# EAGLE schematic ConnectBox_Charger (EAGLE 9.2.2)
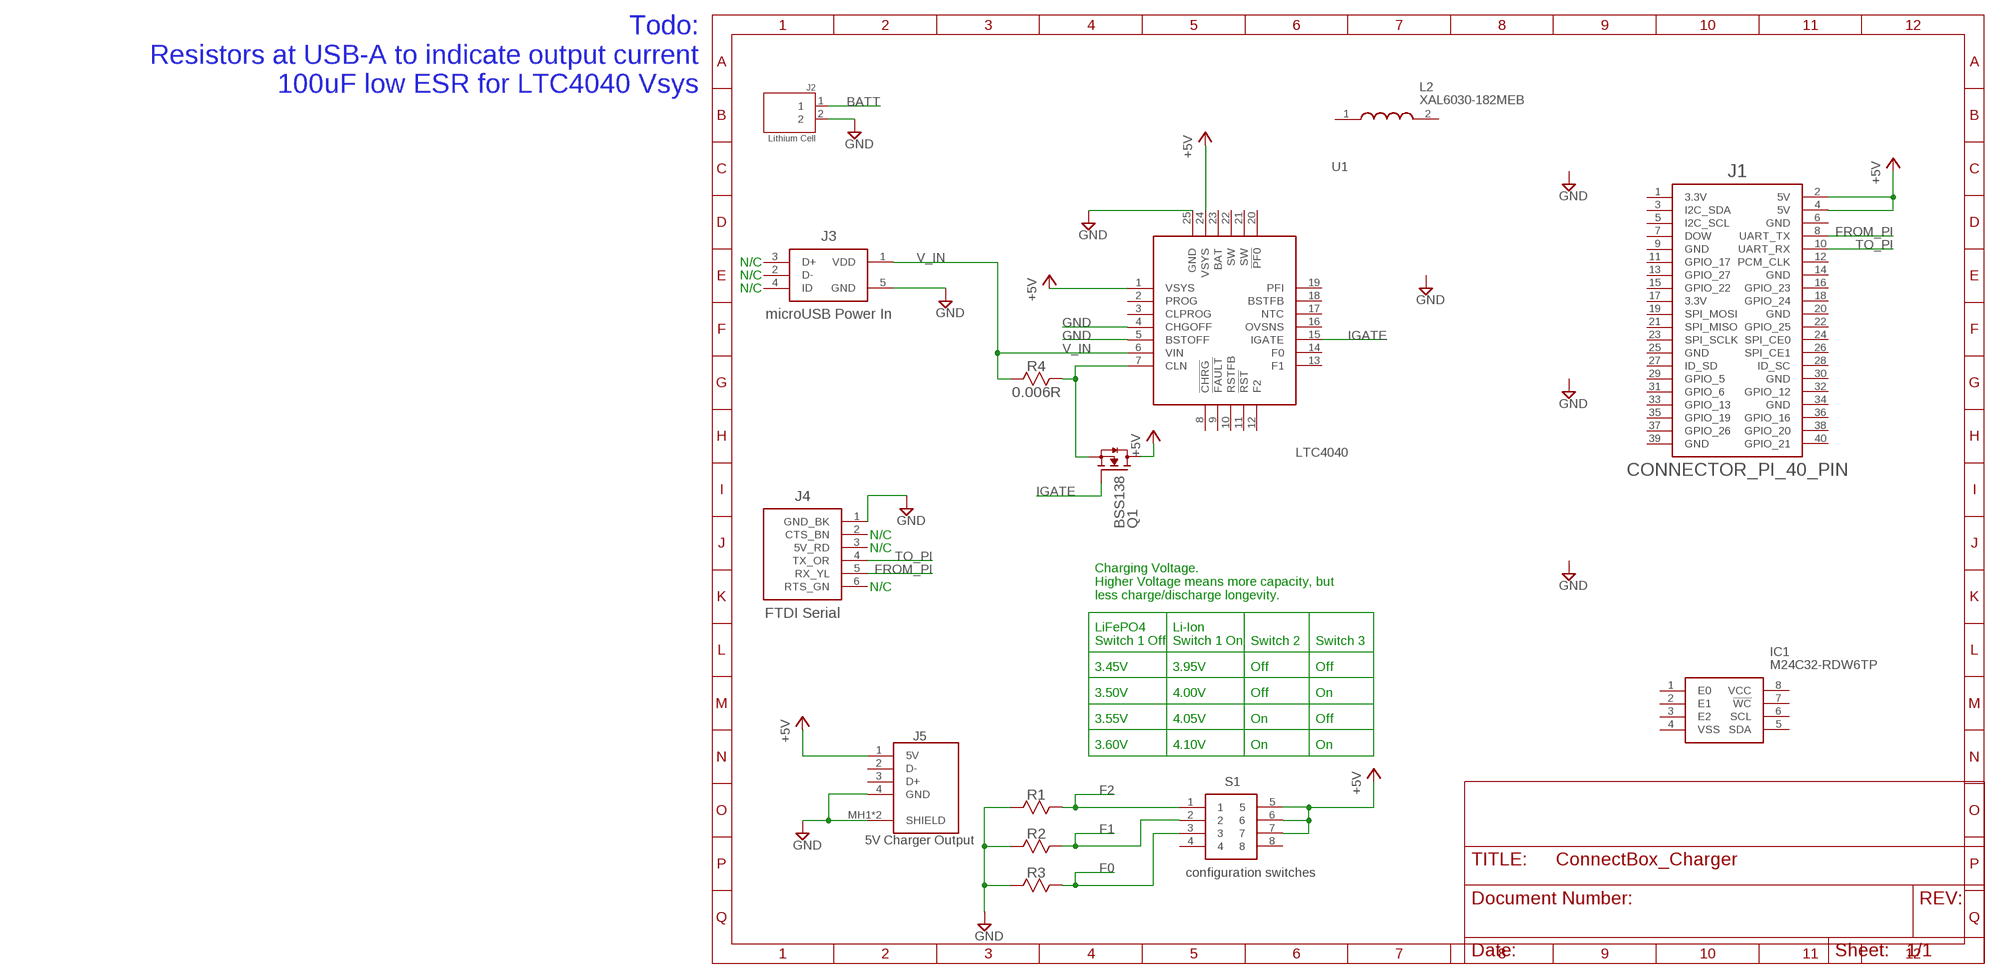
[diagram p0: schematic, sheet 1]

## Parts
IC1  M24C32-RDW6TP  [SOP65P640X120-8N]
J1  CONNECTOR_PI_40_PIN  [2X20]
J2  Lithium Cell  S2B-PH-SM4-TB(LF)(SN)  [JST_S2B-PH-SM4-TB(LF)(SN)]
J3  microUSB Power In  10118194-0001LF  [FRAMATOME_10118194-0001LF]
J4  FTDI Serial  CONNECTOR-6-FTDI  [ESQ-106-XX-X-S]
J5  5V Charger Output  SS-52100-001  [SS52100001]
L2  XAL6030-182MEB  [XAL6030182MEB]
Q1  BSS138  [BSS138]
R1  RESISTOR0603  [RESC1608X55L25N]
R2  RESISTOR0603  [RESC1608X55L25N]
R3  RESISTOR0603  [RESC1608X55L25N]
R4  0.006R  RESISTOR0603  [RESC1608X55L25N]
S1  configuration switches  219-4LPST  [219-4LPST]
U1  LTC4040  [QFN50P500X400X80-25N]

## Nets
+5V: J1.2(5V) J1.4(5V) J5.1(5V) Q1.D S1.5 S1.6 S1.7 U1.1(VSYS) U1.24(VSYS)
BATT: J2.1
F0: R3.2 S1.3
F1: R2.2 S1.2
F2: R1.2 S1.1
FROM_PI: J1.8(UART_TX) J4.5(RX_YL)
GND: J2.2 J3.5(GND) J4.1(GND_BK) J5.4(GND) J5.MH1(SHIELD) J5.MH2(SHIELD) R1.1 R2.1 R3.1 U1.4(CHGOFF) U1.5(BSTOFF) U1.25(GND)
IGATE: Q1.G U1.15(IGATE)
N$2: Q1.S R4.2 U1.7(CLN)
TO_PI: J1.10(UART_RX) J4.4(TX_OR)
V_IN: J3.1(VDD) R4.1 U1.6(VIN)
Unconnected: IC1.1(E0) IC1.2(E1) IC1.3(E2) IC1.4(VSS) IC1.5(SDA) IC1.6(SCL) IC1.7(!WC) IC1.8(VCC) J1.1(3.3V) J1.3(I2C_SDA) J1.5(I2C_SCL) J1.6(GND) J1.7(DOW) J1.9(GND) J1.11(GPIO_17) J1.12(PCM_CLK) J1.13(GPIO_27) J1.14(GND) J1.15(GPIO_22) J1.16(GPIO_23) J1.17(3.3V) J1.18(GPIO_24) J1.19(SPI_MOSI) J1.20(GND) J1.21(SPI_MISO) J1.22(GPIO_25) J1.23(SPI_SCLK) J1.24(SPI_CE0) J1.25(GND) J1.26(SPI_CE1) J1.27(ID_SD) J1.28(ID_SC) J1.29(GPIO_5) J1.30(GND) J1.31(GPIO_6) J1.32(GPIO_12) J1.33(GPIO_13) J1.34(GND) J1.35(GPIO_19) J1.36(GPIO_16) J1.37(GPIO_26) J1.38(GPIO_20) J1.39(GND) J1.40(GPIO_21) J3.2(D-) J3.3(D+) J3.4(ID) J4.2(CTS_BN) J4.3(5V_RD) J4.6(RTS_GN) J5.2(D-) J5.3(D+) L2.1 L2.2 S1.4 S1.8 U1.2(PROG) U1.3(CLPROG) U1.8(!CHRG) U1.9(!FAULT) U1.10(RSTFB) U1.11(!RST) U1.12(F2) U1.13(F1) U1.14(F0) U1.16(OVSNS) U1.17(NTC) U1.18(BSTFB) U1.19(PFI) U1.20(!PF0) U1.21(SW) U1.22(SW) U1.23(BAT)

## Notes on the sheet
- Todo:
  Resistors at USB-A to indicate output current
  100uF low ESR for LTC4040 Vsys
- N/C
- N/C
- N/C
- N/C
- N/C
- N/C
- Charging Voltage.
  Higher Voltage means more capacity, but
  less charge/discharge longevity.
- LiFePO4
  Switch 1 Off
- Li-Ion
  Switch 1 On
- Switch 2 | Switch 3
- 3.45V | 3.95V | Off | Off
- 3.50V | 4.00V | Off | On
- 3.55V | 4.05V | On | Off
- 3.60V | 4.10V | On | On

## Library data of the parts
IC1 = ConnectBox_2019:M24C32-RDW6TP: STMICROELECTRONICS - M24C32-RDW6TP - EEPROM, 32KBIT, I2C, 1MHZ, TSSOP-8 Source: Datasheet <http://www.st.com/content/ccc/resource/technical/document/datasheet/80/4e/8c/54/f2/63/4c/4a/CD00001012.pdf/files/CD00001012.pdf/jcr:content/translations/en.CD00001012.pdf>; DESCRIPTION: STMICROELECTRONICS - M24C32-RDW6TP - EEPROM, 32KBIT, I2C, 1MHZ, TSSOP-8; HEIGHT: 1.2mm; MANUFACTURER_NAME: STMicroelectronics; MANUFACTURER_PART_NUMBER: M24C32-RDW6TP; MOUSER_PART_NUMBER: 511-M24C32-RDW6TP; MOUSER_PRICE-STOCK: https://www.mouser.com/Search/Refine.aspx?Keyword=511-M24C32-RDW6TP
J1 = ConnectBox_2019:CONNECTOR_PI_40_PIN
J2 = ConnectBox_2019:S2B-PH-SM4-TB(LF)(SN): PH Series 2 Position 2 mm Pitch Surface Mount Side Entry Shrouded Header; AVAILABILITY: Unavailable; DESCRIPTION: PH Series 2 Position 2 mm Pitch Surface Mount Side Entry Shrouded Header; MF: JST Sales; MP: S2B-PH-SM4-TB_LF__SN_; PACKAGE: FakePackage u; PRICE: None
J3 = ConnectBox_2019:10118194-0001LF: Conn Micro USB Type B RCP 5 POS 0.65mm Solder RA SMD 5 Terminal 1 Port T/R from SnapEDA; AVAILABILITY: Good; DESCRIPTION: Conn Micro USB Type B RCP 5 POS 0.65mm Solder RA SMD 5 Terminal 1 Port T/R; MF: FCI; MP: 10118194-0001LF; PACKAGE: DIP-4 FCI; PRICE: 0.24 USD
J4 = ConnectBox_2019:CONNECTOR-6-FTDI
J5 = ConnectBox_2019:SS-52100-001: STEWART CONNECTOR - SS-52100-001 - USB CONN, 2.0 TYPE A, RCPT, 4POS, TH Source: Datasheet <https://componentsearchengine.com/Datasheets/1/SS-52100-001.pdf>; DESCRIPTION: STEWART CONNECTOR - SS-52100-001 - USB CONN, 2.0 TYPE A, RCPT, 4POS, TH; HEIGHT: 6.9mm; MANUFACTURER_NAME: Bel-Stewart; MANUFACTURER_PART_NUMBER: SS-52100-001; MOUSER_PART_NUMBER: 530-SS-52100-001; MOUSER_PRICE-STOCK: https://www.mouser.com/Search/Refine.aspx?Keyword=530-SS-52100-001
L2 = ConnectBox_2019:XAL6030-182MEB: Fixed Inductors 1.8uH 20% 14A 10.52mOhms AEC-Q200 Source: Datasheet <https://www.coilcraft.com/pdfs/xal60xx.pdf>; DESCRIPTION: Fixed Inductors 1.8uH 20% 14A 10.52mOhms AEC-Q200; HEIGHT: 3.1mm; MANUFACTURER_NAME: COILCRAFT; MANUFACTURER_PART_NUMBER: XAL6030-182MEB; MOUSER_PART_NUMBER: 994-XAL6030-182MEB; MOUSER_PRICE-STOCK: https://www.mouser.com/Search/Refine.aspx?Keyword=994-XAL6030-182MEB
Q1 = APU_ENGR480_UPS_EAGLE_Library:BSS138: BSS138 N-Channel Logic Level Enhancement Mode Field Effect Transistor from SnapEDA; AVAILABILITY: Good; DESCRIPTION: B138 Series 50 V 6 Ohms N-Ch Logic Level Enhancement Mode FET - SOT-23-3; MF: Fairchild Semiconductor; MP: BSS138; PACKAGE: SOT-23-3 Fairchild Semiconductor; PRICE: 19.46 USD
R1-R4 = ConnectBox_2019:RESISTOR
S1 = ConnectBox_2019:219-4LPST: Series 219, SMD DIP-switch Source: Datasheet <http://www.ctscorp.com/wp-content/uploads/2015/11/219.pdf>; DESCRIPTION: Series 219, SMD DIP-switch; HEIGHT: mm; MANUFACTURER_NAME: CTS; MANUFACTURER_PART_NUMBER: 219-4LPST; MOUSER_PART_NUMBER: 774-2194LPST; MOUSER_PRICE-STOCK: https://www.mouser.com/Search/Refine.aspx?Keyword=774-2194LPST; RS_PART_NUMBER: 1774220; RS_PRICE-STOCK: http://uk.rs-online.com/web/p/products/1774220
U1 = ConnectBox_2019:LTC4040